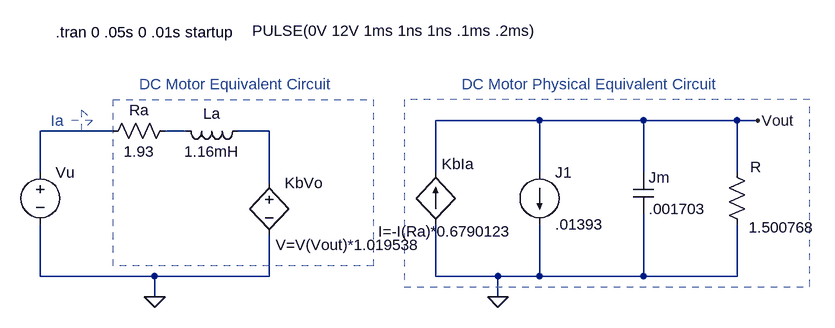
[diagram p0: schematic MotorModel.asc]
MotorModel.asc, the LTspice schematic file:
Version 4
SHEET 1 984 680
WIRE 336 -16 176 -16
WIRE 496 -16 336 -16
WIRE 640 -16 496 -16
WIRE 672 -16 640 -16
WIRE -320 0 -432 0
WIRE -208 0 -240 0
WIRE -80 0 -128 0
WIRE -432 64 -432 0
WIRE 176 64 176 -16
WIRE 336 64 336 -16
WIRE 496 64 496 -16
WIRE 640 64 640 -16
WIRE -80 80 -80 0
WIRE -432 224 -432 144
WIRE -256 224 -432 224
WIRE -80 224 -80 160
WIRE -80 224 -256 224
WIRE 176 224 176 144
WIRE 272 224 176 224
WIRE 336 224 336 144
WIRE 336 224 272 224
WIRE 496 224 496 128
WIRE 496 224 336 224
WIRE 640 224 640 144
WIRE 640 224 496 224
WIRE -256 256 -256 224
WIRE 272 256 272 224
FLAG 272 256 0
FLAG -256 256 0
FLAG 672 -16 Vout
SYMBOL res -224 -16 R90
WINDOW 0 0 56 VBottom 2
WINDOW 3 32 56 VTop 2
SYMATTR InstName Ra
SYMATTR Value 1.93
SYMBOL ind -112 -16 R90
WINDOW 0 5 56 VBottom 2
WINDOW 3 32 56 VTop 2
SYMATTR InstName La
SYMATTR Value 1.16mH
SYMBOL bi 176 144 R180
WINDOW 0 -59 93 Left 2
WINDOW 3 -119 -11 Left 2
SYMATTR InstName KbIa
SYMATTR Value I=-I(Ra)*0.6790123
SYMBOL cap 480 64 R0
SYMATTR InstName Jm
SYMATTR Value .001703
SYMBOL current 336 64 R0
WINDOW 123 0 0 Left 2
WINDOW 39 0 0 Left 2
SYMATTR InstName J1
SYMATTR Value .01393
SYMBOL voltage -432 48 R0
WINDOW 3 326 -202 Left 2
WINDOW 123 0 0 Left 2
WINDOW 39 0 0 Left 2
SYMATTR Value PULSE(0V 12V 1ms 1ns 1ns .1ms .2ms)
SYMATTR InstName Vu
SYMBOL res 624 48 R0
WINDOW 0 36 8 Left 2
WINDOW 3 34 101 Left 2
SYMATTR InstName R
SYMATTR Value 1.500768
SYMBOL bv -80 64 R0
WINDOW 3 10 112 Left 2
SYMATTR Value V=V(Vout)*1.019538
SYMATTR InstName KbVo
TEXT -416 -16 Left 2 ;Ia
TEXT -280 -72 Left 2 ;DC Motor Equivalent Circuit
TEXT 216 -72 Left 2 ;DC Motor Physical Equivalent Circuit
TEXT -408 -152 Left 2 !.tran 0 .05s 0 .01s startup
LINE Normal -352 -16 -384 -16 2
LINE Normal -368 -32 -352 -16 2
LINE Normal -368 0 -368 -32 2
LINE Normal -352 -16 -368 0 2
RECTANGLE Normal 80 208 -320 -48 2
RECTANGLE Normal 128 240 752 -48 2

The netlist it stands for:
* MotorModel.asc
Ra N002 N001 1.93
La N003 N002 1.16mH
B§KbIa 0 Vout I=-I(Ra)*0.6790123
C§Jm Vout 0 .001703
I§J1 Vout 0 .01393
Vu N001 0 PULSE(0V 12V 1ms 1ns 1ns .1ms .2ms)
R Vout 0 1.500768
B§KbVo N003 0 V=V(Vout)*1.019538
* Ia
* DC Motor Equivalent Circuit
* DC Motor Physical Equivalent Circuit
.tran 0 .05s 0 .01s startup
.backanno
.end